# EAGLE design BinMonitored (EAGLE 7.4.0)
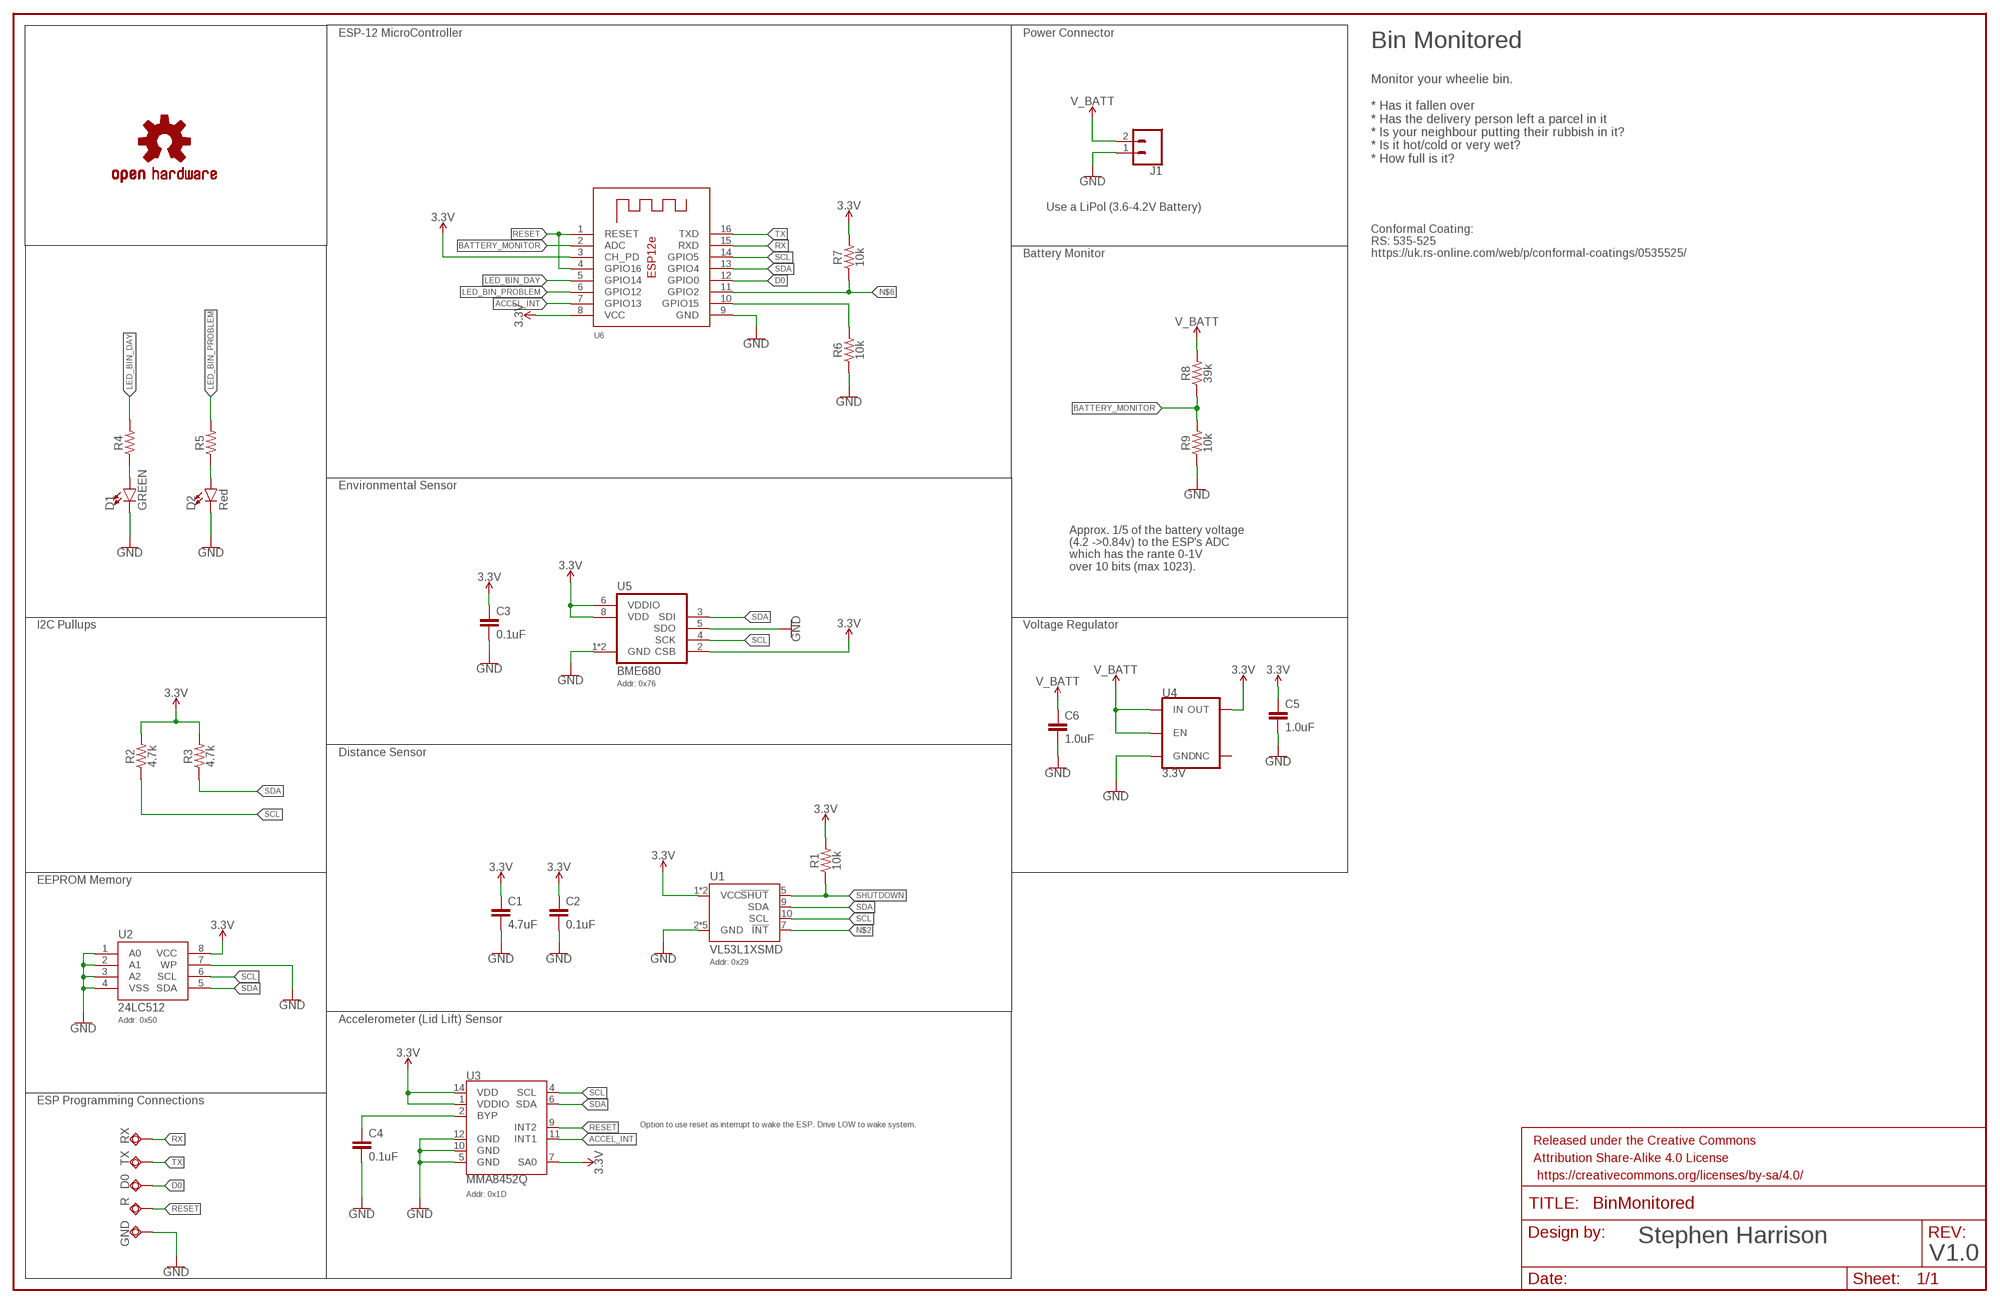
[diagram p0: schematic, sheet 1]

## Parts
C1  4.7uF  4.7UF-0603-6.3V-(10%)  [0603]
C2  0.1uF  0.1UF-0603-25V-5%  [0603]
C3  0.1uF  0.1UF-0603-25V-5%  [0603]
C4  0.1uF  0.1UF-0603-25V-5%  [0603]
C5  1.0uF  0.1UF-0603-25V-5%  [0603]
C6  1.0uF  0.1UF-0603-25V-5%  [0603]
D0  TPSQTP10SQ  [TP10SQ]
D1  GREEN  LED-GREEN1206  [LED-1206]
D2  Red  LED-GREEN1206  [LED-1206]
FRAME1  FRAME-LEDGER  [CREATIVE_COMMONS]
GND  TPSQTP10SQ  [TP10SQ]
J1  CONN_02-JST-2MM-SMT  [JST-2-SMD]
LOGO1  OSHW-LOGOL  [OSHW-LOGO-L]
R  TPSQTP10SQ  [TP10SQ]
R1  10k  10KOHM-0603-1/10W-1%  [0603]
R2  4.7k  4.7KOHM-0603-1/10W-1%  [0603]
R3  4.7k  4.7KOHM-0603-1/10W-1%  [0603]
R4  RESISTOR0805  [0805]
R5  RESISTOR0805  [0805]
R6  10k  10KOHM-0603-1/10W-1%  [0603]
R7  10k  10KOHM-0603-1/10W-1%  [0603]
R8  39k  RESISTOR0603  [0603]
R9  10k  RESISTOR0603  [0603]
RX  TPSQTP10SQ  [TP10SQ]
TX  TPSQTP10SQ  [TP10SQ]
U1  VL53L1XSMD  [VL53L1X]
U2  24LC512  EEPROM-I2CSMD  [SO08]
U3  MMA8452Q  [QFN-16]
U4  3.3V  V_REG_AP2112K-3.3V  [SOT23-5]
U5  BME680  [BME680]
U6  ESP-12E  [ESP-12E]

## Nets
3.3V: C1.1 C2.1 C3.1 C5.1 R1.2 R2.2 R3.2 R7.2 U1.1(VCC) U1.11(VCC) U2.8(VCC) U3.1(VDDIO) U3.7(SA0) U3.14(VDD) U4.5(OUT) U5.2(CSB) U5.6(VDDIO) U5.8(VDD) U6.3(CH_PD) U6.8(VCC)
ACCEL_INT: U3.11(INT1) U6.7(GPIO13)
BATTERY_MONITOR: R8.1 R9.2 U6.2(ADC)
D0: D0.TP U6.12(GPIO0)
GND: C1.2 C2.2 C3.2 C4.2 C5.2 C6.2 D1.C D2.C GND.TP J1.1 R6.1 R9.1 U1.2(GND) U1.3(GND) U1.4(GND) U1.6(GND) U1.12(GND) U2.1(A0) U2.2(A1) U2.3(A2) U2.4(VSS) U2.7(WP) U3.5(GND) U3.10(GND) U3.12(GND) U4.2(GND) U5.1(GND) U5.5(SDO) U5.7(GND) U6.9(GND)
GPIO15: R6.2 U6.10(GPIO15)
LED_BIN_DAY: R4.2 U6.5(GPIO14)
LED_BIN_PROBLEM: R5.2 U6.6(GPIO12)
N$2: U1.7(!INT)
N$6: R7.1 U6.11(GPIO2)
N$15: C4.1 U3.2(BYP)
N$19: D1.A R4.1
N$20: D2.A R5.1
RESET: R.TP U3.9(INT2) U6.1(RESET) U6.4(GPIO16)
RX: RX.TP U6.15(RXD)
SCL: R2.1 U1.10(SCL) U2.6(SCL) U3.4(SCL) U5.4(SCK) U6.14(GPIO5)
SDA: R3.1 U1.9(SDA) U2.5(SDA) U3.6(SDA) U5.3(SDI) U6.13(GPIO4)
SHUTDOWN: R1.1 U1.5(!SHUT)
TX: TX.TP U6.16(TXD)
V_BATT: C6.1 J1.2 R8.2 U4.1(IN) U4.3(EN)
Unconnected: U4.4(NC)

## Notes on the sheet
- ESP-12 MicroController | Power Connector
- Bin Monitored
- Monitor your wheelie bin.
  
  * Has it fallen over
  * Has the delivery person left a parcel in it
  * Is your neighbour putting their rubbish in it?
  * Is it hot/cold or very wet?
  * How full is it?
- Use a LiPol (3.6-4.2V Battery)
- Battery Monitor
- Conformal Coating:
  RS: 535-525
  https://uk.rs-online.com/web/p/conformal-coatings/0535525/
- Environmental Sensor
- Approx. 1/5 of the battery voltage 
  (4.2 ->0.84v) to the ESP's ADC 
  which has the rante 0-1V 
  over 10 bits (max 1023).
- I2C Pullups | Voltage Regulator
- Addr: 0x76
- Distance Sensor
- EEPROM Memory
- Addr: 0x29
- Addr: 0x50 | Accelerometer (Lid Lift) Sensor
- ESP Programming Connections
- Option to use reset as interrupt to wake the ESP. Drive LOW to wake system.
- Addr: 0x1D
- Stephen Harrison
- V1.0

## Library data of the parts
C1 = SparkFun-Capacitors:4.7UF: 4.7µF ceramic capacitors A capacitor is a passive two-terminal electrical component used to store electrical energy temporarily in an electric field.; PROD_ID: CAP-08280
C2-C4 = SparkFun-Capacitors:0.1UF: 0.1µF ceramic capacitors A capacitor is a passive two-terminal electrical component used to store electrical energy temporarily in an electric field.; PROD_ID: CAP-08604
C5 C6 = SparkFun-Capacitors:0.1UF: 0.1µF ceramic capacitors A capacitor is a passive two-terminal electrical component used to store electrical energy temporarily in an electric field.; PROD_ID: CAP-08604; VALUE: 0.1uF
D0 GND R RX TX = testpad:TPSQ: Test pad
D1 = SparkFun-LED:LED-GREEN: Green SMD LED Used in manufacturing of various products at SparkFun Packages: 0603 - SMD 0603 package [Product Link] <http://www.futureelectronics.com/en/technologies/semiconductors/optoelectronics/leds/Pages/9894312-LTST-C190GKT.aspx?CrossPart=HSMG-C190&IM=0> LilyPad 1206 - SMD1206 LilyPad package [Product Link] <http://www.futureelectronics.com/en/Technologies/Product.aspx?ProductID=IN150NGHARVATEKCORPORATION2049943&IM=0> 1206 - SMD1206 package [Product Link] <http://www.futureelectronics.com/en/technologies/semiconductors/optoelectronics/leds/Pages/8315665-LTST-C150KGKT.aspx?IM=0> 1206 Bottom Mount -SMD 1206 Bottom Mount [Product Link] <http://www.digikey.com/product-detail/en/lite-on-inc/LTST-C230KGKT/160-1456-1-ND/386854> SparkFun Products: Pro Mini 328 -5V <https://www.sparkfun.com/products/821> RedBoard <https://www.sparkfun.com/products/12757> MP3 Trigger <https://www.sparkfun.com/products/13720> Makey Makey <https://www.sparkfun.com/products/11076>; PROD_ID: DIO-00862
D2 = SparkFun-LED:LED-GREEN: Green SMD LED Used in manufacturing of various products at SparkFun Packages: 0603 - SMD 0603 package [Product Link] <http://www.futureelectronics.com/en/technologies/semiconductors/optoelectronics/leds/Pages/9894312-LTST-C190GKT.aspx?CrossPart=HSMG-C190&IM=0> LilyPad 1206 - SMD1206 LilyPad package [Product Link] <http://www.futureelectronics.com/en/Technologies/Product.aspx?ProductID=IN150NGHARVATEKCORPORATION2049943&IM=0> 1206 - SMD1206 package [Product Link] <http://www.futureelectronics.com/en/technologies/semiconductors/optoelectronics/leds/Pages/8315665-LTST-C150KGKT.aspx?IM=0> 1206 Bottom Mount -SMD 1206 Bottom Mount [Product Link] <http://www.digikey.com/product-detail/en/lite-on-inc/LTST-C230KGKT/160-1456-1-ND/386854> SparkFun Products: Pro Mini 328 -5V <https://www.sparkfun.com/products/821> RedBoard <https://www.sparkfun.com/products/12757> MP3 Trigger <https://www.sparkfun.com/products/13720> Makey Makey <https://www.sparkfun.com/products/11076>; PROD_ID: DIO-00862; VALUE: GREEN
FRAME1 = SparkFun-Aesthetics:FRAME-LEDGER: Schematic Frame - Ledger Standard 11x14 US Ledger frame
J1 = SparkFun-Connectors:CONN_02: Multi connection point. Often used as Generic Header-pin footprint for 0.1 inch spaced/style header connections On any of the 0.1 inch spaced packages, you can populate with these: Break Away Headers - Straight <https://www.sparkfun.com/products/116> (PRT-00116) Break Away Male Headers - Right Angle <https://www.sparkfun.com/products/553> (PRT-00553) Female Headers <https://www.sparkfun.com/products/115> (PRT-00115) Break Away Headers - Machine Pin <https://www.sparkfun.com/products/117> (PRT-00117) Break Away Female Headers - Swiss Machine Pin <https://www.sparkfun.com/products/743> (PRT-00743) For SCREWTERMINALS and SPRING TERMINALS visit here: Screw Terimnals on SparkFun.com <https://www.sparkfun.com/search/results?term=Screw+Terminals> (5mm/3.5mm/2.54mm spacing) This device is also useful as a general connection point to wire up your design to another part of your project. Our various solder wires solder well into these plated through hole pads. Hook-Up Wire - Assortment (Stranded, 22 AWG) <https://www.sparkfun.com/products/11375> (PRT-11375) Hook-Up Wire - Assortment (Solid Core, 22 AWG) <https://www.sparkfun.com/products/11367> (PRT-11367) View the entire wire category on our website here <https://www.sparkfun.com/categories/141> Special notes: Molex polarized connector foot print use with: PRT-08233 with associated crimp pins and housings. 2.54_SCREWTERM for use with PRT-10571. 3.5mm Screw Terminal footprints for PRT-08084 5mm Screw Terminal footprints for use with PRT-08432; PROD_ID: CONN-11443
LOGO1 = SparkFun-Aesthetics:OSHW-LOGO: Open-Source Hardware (OSHW) Logo This logo indicates the piece of hardware it is found on incorporates a OSHW license and/or adheres to the definition of open source hardware found here: http://freedomdefined.org/OSHW
R1 R6 R7 = SparkFun-Resistors:10KOHM: 10kΩ resistor A resistor is a passive two-terminal electrical component that implements electrical resistance as a circuit element. Resistors act to reduce current flow, and, at the same time, act to lower voltage levels within circuits. - Wikipedia; PROD_ID: RES-00824
R2 R3 = SparkFun-Resistors:4.7KOHM: 4.7kΩ resistor A resistor is a passive two-terminal electrical component that implements electrical resistance as a circuit element. Resistors act to reduce current flow, and, at the same time, act to lower voltage levels within circuits. - Wikipedia; PROD_ID: RES-07857
R4 R5 R8 R9 = SparkFun-Resistors:RESISTOR: Generic Resistor Package
U1 = SparkFun-Sensors:VL53L1X: STMicroelectronics VL53L1X - 400 cm IR Laser ToF Sensor VL53L1X is a state-of-the-art ToF laser-ranging sensor, enhancing the ST FlightSense product family. It is the fastest miniature ToF sensor currently on the market with accurate ranging up to 4 m and fast ranging frequency (up to 50 Hz). Housed in a miniature and reflowable package, it integrates a single photon avalanche diode (SPAD) receiving array, a 940 nm invisible laser Class 1 emitter, physical infrared filters, and optics to achieve the best ranging performance in various ambient lighting conditions with a range of cover window options.; PROD_ID: IC-13960
U2 = SparkFun-IC-Memory:EEPROM-I2C: I2C EEPROMs, 24LC256 and others 24LC256 Series 256 kb I2C 2 Wire (32 k x 8 Bit) 2.5 V Serial EEPROM SMD - SOIC-8 Datasheet SparkFun Products SparkFun UDB5 - PIC UAV Development Board <https://www.sparkfun.com/products/11703> (GPS-11703); PROD_ID: IC-09714; VALUE: 24LC256
U3 = SparkFun-Sensors:MMA8452Q: NXP MMA8452Q 3-Axis Digital Accelerometer The MMA8452Q is a smart low-power, three-axis, capacitive MEMS accelerometer with 12 bits of resolution. This accelerometer is packed with embedded functions with flexible user programmable options, configurable to two interrupt pins. Supply Voltage: 1.6-3.6V Range: +/- 2g, 4g, 8g Interface: I2C, 12-bit and 8-bit ODR: 1.56 Hz - 800 Hz Package: QFN-16 Datasheet <http://cache.freescale.com/files/sensors/doc/data_sheet/MMA8452Q.pdf> SparkFun Products SparkFun Triple Axis Accelerometer Breakout - MMA8452Q <https://www.sparkfun.com/products/12756> (SEN-12756) SparkFun RedBot Sensor - Accelerometer <https://www.sparkfun.com/products/12589> (SEN-12589); PROD_ID: IC-10769
U4 = SparkFun-IC-Power:V_REG_AP2112: AP2112 - 600mA CMOS LDO Regulator w/ Enable The AP2112 is CMOS process low dropout linear regulator with enable function, the regulator delivers a guaranteed 600mA (min.) continuous load current. Features Output Voltage Accuracy: ±1.5% Output Current: 600mA (Min.) Foldback Short Current Protection: 50mA Enable Function to Turn ON/OFF VOUT Low Dropout Voltage (3.3V): 250mV (Typ.) @IOUT=600mA Excellent Load Regulation: 0.2%/A (Typ.) Excellent Line Regulation: 0.02%/V (Typ.) Low Quiescent Current: 55μA (Typ.) Low Standby Current: 0.01μA (Typ.) Low Output Noise: 50μVRMS PSRR: 100Hz -65dB, 1kHz -65dB OTSD Protection Stable with 1.0μF Flexible Cap: Ceramic, Tantalum and Aluminum Electrolytic Operation Temperature Range: -40°C to 85°C ESD: MM 400V, HBM 4000V; PROD_ID: VREG-12457
U5 = ThingySticks:BME680: BME680 integrates for the first time individual high linearity and high accuracy sensors for gas, pressure, humidity and temperature. The library has been designed by Richard Magdycz <https://www.facebook.com/groups/eaglecadsoftUK> Original version had pins in incorrect places (BME680 uses untypical clockwise direction). Updated 17 Feb 2018 S.Harrison ThingySticks.com
U6 = kanflo:ESP-12E: ESP12e module This is a copy of AdaFruit's device with correct pin order for GPIO4 and GPIO5.

## Board
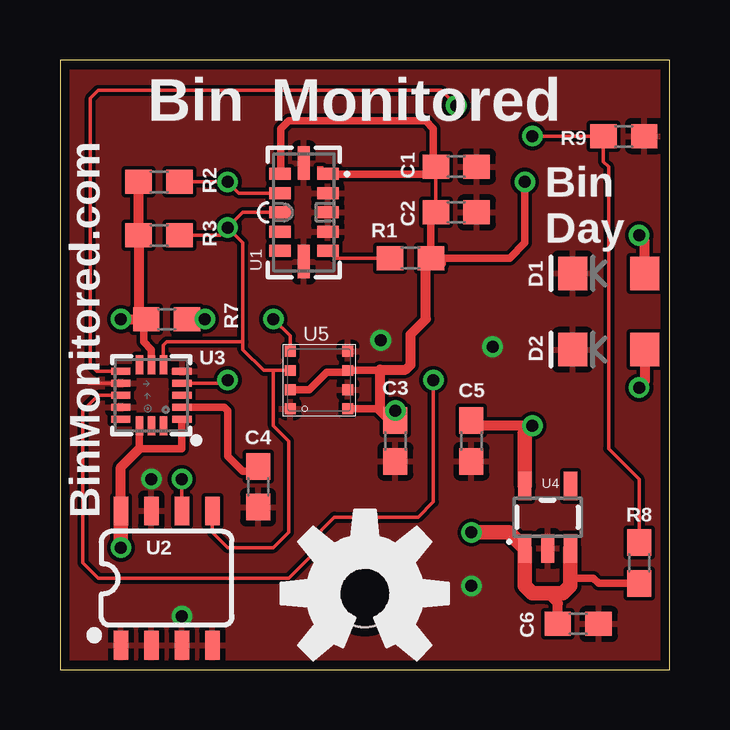
[diagram p1: board, top side]
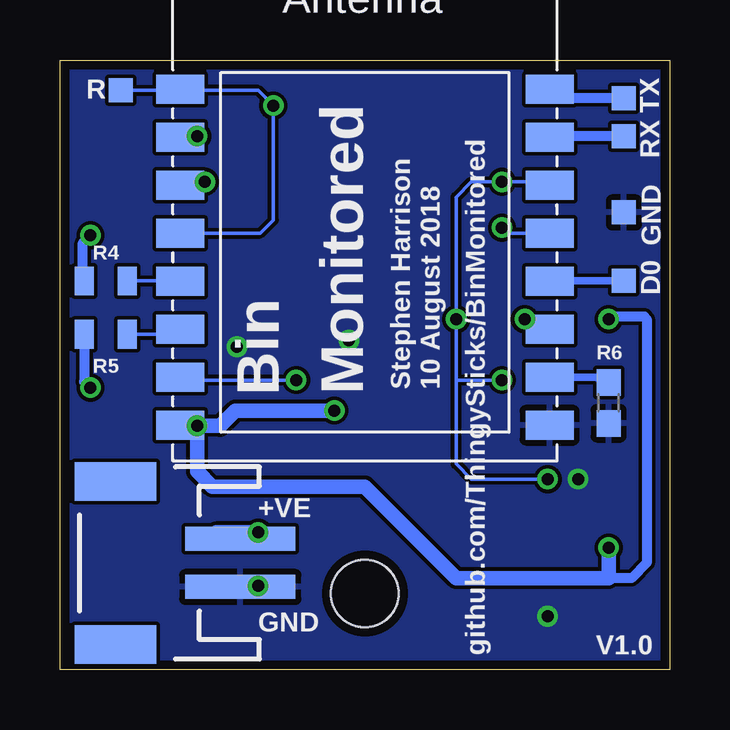
[diagram p2: board, bottom side, seen from below]

Size 25.4 x 25.4 mm. Coordinates in mm from the lower left corner, seen from the top.
Outline: 0,0 25.4,0 25.4,25.4 0,25.4 0,0
Copper layers (1*16): Top 0.0356mm / dielectric 1.5011mm / Bottom 0.0356mm
Design rules "OSHPark": minimum track width 6mil, minimum drill 13mil, track to track 6mil, track to pad 6mil, pad to pad 6mil, via to via 6mil, smd to smd 6mil, copper to edge 15mil, drill to drill 6mil, minimum pad ring 7mil, minimum via ring 7mil, stop-mask expansion 3mil, vias tented up to drill 0mil, thermal gap 10mil
Holes 2.8 mm at 12.7,3.17

### Footprints (pad centres in the part's own frame; a part is rotated, then mirrored left to right if it is on the bottom)
0603 = smd 1.1 x 1: 1 -0.85,0; 2 0.85,0
TP10SQ = smd 1 x 1: TP 0,0
LED-1206 = smd 1.2 x 1.4: A -1.5,0; C 1.5,0
JST-2-SMD = smd 1 x 4.6: 1 -1,-3.7; 2 1,-3.7 | smd 1.6 x 3.4: NC1 -3.4,1.5; NC2 3.4,1.5
0805 = smd 0.8 x 1.2: 1 -0.9,0; 2 0.9,0
VL53L1X = smd 0.5 x 0.9: 1 1.6,-1; 2 0.8,-1; 3 0,-1; 4 -0.8,-1; 5 -1.6,-1; 7 -1.6,1; 8 -0.8,1; 9 0,1; 10 0.8,1; 11 1.6,1 | smd 1.4 x 0.5: 6 -2.05,0; 12 2.05,0
SO08 = smd 0.6 x 1.2: 1 -1.905,-2.8; 2 -0.635,-2.8; 3 0.635,-2.8; 4 1.905,-2.8; 5 1.905,2.8; 6 0.635,2.8; 7 -0.635,2.8; 8 -1.905,2.8
QFN-16 = smd 0.8 x 0.3: 1 -1.275,1; 2 -1.275,0.5; 3 -1.275,0; 4 -1.275,-0.5; 5 -1.275,-1; 9 1.275,-1; 10 1.275,-0.5; 11 1.275,0; 12 1.275,0.5; 13 1.275,1 | smd 0.3 x 0.8: 6 -0.5,-1.275; 7 0,-1.275; 8 0.5,-1.275; 14 0.5,1.275; 15 0,1.275; 16 -0.5,1.275
SOT23-5 = smd 0.55 x 1.2: 1 -0.95,-1.3; 2 0,-1.3; 3 0.95,-1.3; 4 0.95,1.3; 5 -0.95,1.3
BME680 = smd 0.45 x 0.45: 1 1.2,-1.2; 2 0.4,-1.2; 3 -0.4,-1.2; 4 -1.2,-1.2; 5 -1.2,1.2; 6 -0.4,1.2; 7 0.4,1.2; 8 1.2,1.2
ESP-12E = smd 2 x 1.2: 1 -7.7,4.5; 2 -7.7,2.5; 3 -7.7,0.5; 4 -7.7,-1.5; 5 -7.7,-3.5; 6 -7.7,-5.5; 7 -7.7,-7.5; 8 -7.7,-9.5; 9 7.7,-9.5; 10 7.7,-7.5; 11 7.7,-5.5; 12 7.7,-3.5; 13 7.7,-1.5; 14 7.7,0.5; 15 7.7,2.5; 16 7.7,4.5

### Placement (x,y rotation side)
C1  16.51,20.95 0 top
C2  16.51,19.05 0 top
C3  13.97,9.53 270 top
C4  8.26,7.62 270 top
C5  17.14,9.53 270 top
C6  21.59,1.91 0 top
D0  1.91,16.19 0 bottom
D1  22.86,16.51 180 top
D2  22.86,13.34 180 top
FRAME1  20.95,-7.62 0 top  (outside the outline)
GND  1.91,19.05 180 bottom
J1  21.59,4.45 90 bottom
LOGO1  12.7,3.17 0 top
R  22.86,24.13 0 bottom
R1  14.61,17.14 0 top
R2  4.13,20.32 180 top
R3  4.13,18.1 180 top
R4  23.5,16.19 0 bottom
R5  23.5,13.97 0 bottom
R6  2.54,11.11 90 bottom
R7  4.45,14.61 180 top
R8  24.13,4.45 270 top
R9  23.5,22.23 180 top
RX  1.91,22.23 0 bottom
TX  1.91,23.81 0 bottom
U1  10.16,19.05 90 top
U2  4.45,3.81 0 top
U3  3.81,11.43 180 top
U4  20.32,6.35 0 top
U5  10.79,12.06 270 top
U6  12.7,19.68 0 bottom

### Tracks (layer width: path | path; a pad name or v marks a point on that pad's centre or on a via)
3.3V  (via drill 0.5)
  Top 0.152: 15.56,21.17 C1.1 | C1.1 C2.1 | 15.99,20.65 C1.1
  Top 0.305: U1.11 9.2,20.65 9.21,20.95 9.21,22.54 9.53,22.86 15.24,22.86 15.56,22.54 15.56,21.17 | U1.1 15.99,20.65 | U5.8 13.27,10.87 13.34,10.79 | 13.34,12.5 13.1,12.46 U5.6 11.91,12.38 11.11,12.38 10.39,11.66 U5.2 | U3.14 3.31,9.21 5.08,9.21 U3.1 | v19.37,20.32 19.37,17.78 18.73,17.14 R1.2 15.46,18.84 C2.1 | C5.1 17.14,10.16 | U3.7 3.81,13.34 3.49,13.65 3.49,14.29
  Top 0.406: v19.68,10.16 17.14,10.16 | 15.88,16.93 R1.2 15.24,16.93 15.24,14.61 14.61,13.97 14.61,12.7 14.4,12.5 13.34,12.5 13.34,10.79 13.76,10.38 C3.1 v13.97,10.79 | 19.37,8.89 19.37,9.84 | v2.54,14.61 R7.2 | R2.2 R3.2 3.28,14.71 3.49,14.71 R7.2 | U2.8 2.54,8.44 3.31,9.21 | 3.49,14.29 3.49,14.5 R7.2
  Top 0.61: U4.5 19.37,9.84 v19.68,10.16 | U2.8 v2.54,5.08
  Bottom 0.305: v19.37,20.32 20.54,20.32 U6.3
  Bottom 0.406: U6.8 19.71,10.19 v19.68,10.16 | 2.54,3.81 1.59,3.81 0.95,4.45 0.95,14.61 1.05,14.71 2.44,14.71 v2.54,14.61
  Bottom 0.61: v2.54,5.08 2.54,3.81 8.89,3.81 12.7,7.62 19.05,7.62 19.68,8.26 v19.68,10.16 18.73,10.16 18.1,10.79 v13.97,10.79
ACCEL_INT  (via drill 0.5)
  Top 0.152: U3.11 1.59,11.43 0.95,10.79 0.95,4.45 1.59,3.81 9.53,3.81 10.79,5.08 10.79,5.71 11.43,6.35 14.92,6.35 15.56,6.99 v15.56,12.06
  Bottom 0.152: v15.56,12.06 20.28,12.06 U6.7
BATTERY_MONITOR  (via drill 0.5)
  Top 0.152: v19.68,22.23 R9.2 22.64,21.17 22.86,20.95 22.86,9.21 24.13,7.94 R8.1
  Bottom 0.152: v19.68,22.23 20.36,22.23 U6.2
D0
  Bottom 0.305: D0.TP 4.76,16.19 5,16.51 U6.12
GND  (via drill 0.5)
  Top 0.152: U3.10 1.19,11.93 1.05,12.06
  other vias: 3.81,7.94 5.08,2.22 13.37,13.72 17.14,3.49 18.03,13.45
  pour Top: 0,25.4 25.4,25.4 25.4,0 0,0
  pour Bottom (isolate 0.152, rank 4): 0,0 25.4,0 25.4,1.27 25.4,25.4 0,25.4
GPIO15
  Bottom 0.305: U6.10 3.08,12.19 R6.2
LED_BIN_DAY
  Bottom 0.152: R4.2 20.41,16.19 U6.5
LED_BIN_PROBLEM
  Bottom 0.152: R5.2 20.61,13.97 U6.6
N$6  (via drill 0.5)
  Top 0.152: R7.1 v6.03,14.61
  Bottom 0.152: v6.03,14.61 5.42,14.61 U6.11
N$15
  Top 0.305: U3.2 6.85,10.93 6.99,10.79 6.99,8.89 7.62,8.26 8.04,8.26 C4.1
N$19  (via drill 0.5)
  Top 0.152: D1.A 24.36,16.6
  Top 0.406: 24.36,16.6 24.36,17.87 v24.13,18.1
  Bottom 0.152: 24.45,16.46 R4.1
  Bottom 0.406: 24.45,16.46 24.45,17.78 v24.13,18.1
N$20  (via drill 0.5)
  Top 0.152: D2.A 24.36,13.42
  Top 0.406: D2.A 24.36,11.98 v24.13,11.75
  Bottom 0.406: 24.36,13.94 R5.1 24.39,12.01 v24.13,11.75
RESET  (via drill 0.5)
  Top 0.152: U3.9 1.54,12.43 1.27,12.7 1.27,23.81 1.59,24.13 15.88,24.13 v16.51,23.5
  Bottom 0.152: 20.34,24.13 U6.1 | U6.4 17.06,18.18 16.51,18.73 v16.51,23.5 17.14,24.13 20.34,24.13 | R.TP 20.34,24.13
RX
  Bottom 0.305: 5,22.23 U6.15
  Bottom 0.406: RX.TP 4.96,22.23 U6.15
SCL  (via drill 0.5)
  Top 0.152: U1.10 7.46,19.85 v6.99,20.32 R2.1 | U5.4 9.6,13.9 v8.89,14.61 | U3.4 6.85,11.93 v6.99,12.06 | U2.6 v5.08,7.94
  Bottom 0.152: U6.14 5.13,20.32 v6.99,20.32 8.26,20.32 8.89,19.68 v8.89,14.61 8.89,12.06 | v6.99,12.06 8.89,12.06 | v5.08,7.94 8.26,7.94 8.89,8.57 8.89,12.06
  Bottom 0.305: 5,20.32 U6.14
SDA  (via drill 0.5)
  Top 0.152: v6.99,18.41 7.62,19.05 U1.9 | U5.3 8.89,12.46 | 8.89,12.46 8.49,12.46 7.62,13.34 7.62,13.65 | 7.62,13.65 7.62,17.78 v6.99,18.41 | U3.6 4.31,13.52 4.45,13.65 7.62,13.65 | R3.1 6.67,18.1 v6.99,18.41 | U2.5 6.35,5.71 6.99,5.08 8.89,5.08 9.53,5.71 9.53,9.53 8.89,10.16 8.89,12.46
  Bottom 0.152: U6.13 6.75,18.18 v6.99,18.41
  Bottom 0.305: 5,18.1 U6.13
SHUTDOWN
  Top 0.152: R1.1 11.46,17.14 U1.5
TX
  Bottom 0.406: TX.TP 4.63,23.81 U6.16
V_BATT  (via drill 0.5)
  Top 0.305: R8.2 22.44,3.6 22.23,3.81 21.27,3.81
  Top 0.406: C6.1 20.74,2.75 20.32,3.17
  Top 0.61: U4.3 21.27,3.81 21.27,3.49 20.95,3.17 20.32,3.17 19.68,3.17 19.37,3.49 U4.1 18.7,5.71 v17.14,5.71
  Bottom 0.61: v17.14,5.71 18.89,5.71 J1.2

### Text on the board
tNames: Bin | Monitored | Bin / Day | BinMonitored.com
bNames: 10 August 2018 | Stephen Harrison | Monitored | Bin | +VE | GND | V1.0 | github.com/ThingySticks/BinMonitored